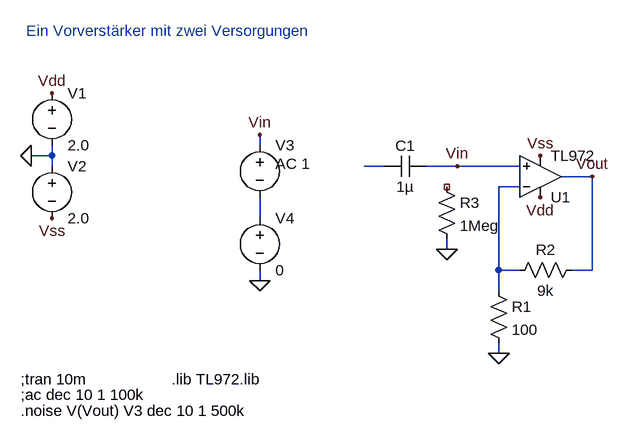
[diagram p0: schematic preamplifier_zv.asc]
preamplifier_zv.asc, the LTspice schematic file:
Version 4
SHEET 1 880 680
WIRE -224 80 -224 64
WIRE -544 96 -544 80
WIRE -544 96 -576 96
WIRE -544 112 -544 96
WIRE -32 112 -64 112
WIRE 80 112 32 112
WIRE 176 112 80 112
WIRE 288 128 240 128
WIRE 176 144 144 144
WIRE -224 192 -224 160
WIRE 64 240 64 224
WIRE 144 272 144 144
WIRE 176 272 144 272
WIRE 288 272 288 128
WIRE 288 272 256 272
WIRE -224 288 -224 272
WIRE 144 304 144 272
WIRE 144 400 144 384
FLAG -544 0 Vdd
FLAG -576 96 0
FLAG -544 192 Vss
FLAG 208 160 Vdd
FLAG 208 96 Vss
FLAG 144 400 0
FLAG -224 288 0
FLAG 80 112 Vin
FLAG -224 64 Vin
FLAG 64 240 0
FLAG 288 128 Vout
SYMBOL voltage -544 -16 R0
WINDOW 123 0 0 Left 0
WINDOW 39 0 0 Left 0
SYMATTR InstName V1
SYMATTR Value 2.0
SYMBOL voltage -544 96 R0
WINDOW 123 0 0 Left 0
WINDOW 39 0 0 Left 0
SYMATTR InstName V2
SYMATTR Value 2.0
SYMBOL res 128 288 R0
SYMATTR InstName R1
SYMATTR Value 100
SYMBOL res 272 256 R90
WINDOW 0 0 56 VBottom 2
WINDOW 3 32 56 VTop 2
SYMATTR InstName R2
SYMATTR Value 9k
SYMBOL voltage -224 64 R0
WINDOW 3 24 96 Invisible 2
WINDOW 123 24 44 Left 2
WINDOW 39 0 0 Left 0
SYMATTR Value SINE(0 10m 1k)
SYMATTR Value2 AC 1
SYMATTR InstName V3
SYMBOL voltage -224 176 R0
WINDOW 123 0 0 Left 0
WINDOW 39 0 0 Left 0
SYMATTR InstName V4
SYMATTR Value 0
SYMBOL cap 32 96 R90
WINDOW 0 0 32 VBottom 2
WINDOW 3 32 32 VTop 2
SYMATTR InstName C1
SYMATTR Value 1µ
SYMBOL res 48 128 R0
SYMATTR InstName R3
SYMATTR Value 1Meg
SYMBOL OpAmps\\opamp2 208 192 M180
SYMATTR InstName U1
SYMATTR Value TL972
TEXT -592 440 Left 2 !;tran 10m
TEXT -592 464 Left 2 !;ac dec 10 1 100k
TEXT -584 -96 Left 2 ;Ein Vorverstärker mit zwei Versorgungen
TEXT -360 440 Left 2 !.lib TL972.lib
TEXT -592 488 Left 2 !.noise V(Vout) V3 dec 10 1 500k

The netlist it stands for:
* preamplifier_zv.asc
V1 Vdd 0 2.0
V2 0 Vss 2.0
R1 N002 0 100
R2 Vout N002 9k
V3 Vin N003 SINE(0 10m 1k) AC 1
V4 N003 0 0
C1 Vin N001 1µ
R3 NC_01 0 1Meg
XU1 Vin N002 Vdd Vss Vout TL972  ; pins In+ In- V+ V- OUT
;tran 10m
;ac dec 10 1 100k
* Ein Vorverstärker mit zwei Versorgungen
.lib TL972.lib
.noise V(Vout) V3 dec 10 1 500k
.backanno
.end